# Altium schematic sheet Voltege_inverter.SchDoc
size 420 x 297 mm; CheckedBy: Филатов Д.М.; Author: Бондарчук А.П.; CompanyName: СПбГЭТУ "ЛЭТИ"; Organization: СПбГЭТУ "ЛЭТИ"; DocumentNumber: ЛЭТИ.0000.01 Э3; SheetNumber: 1; SheetTotal: 4
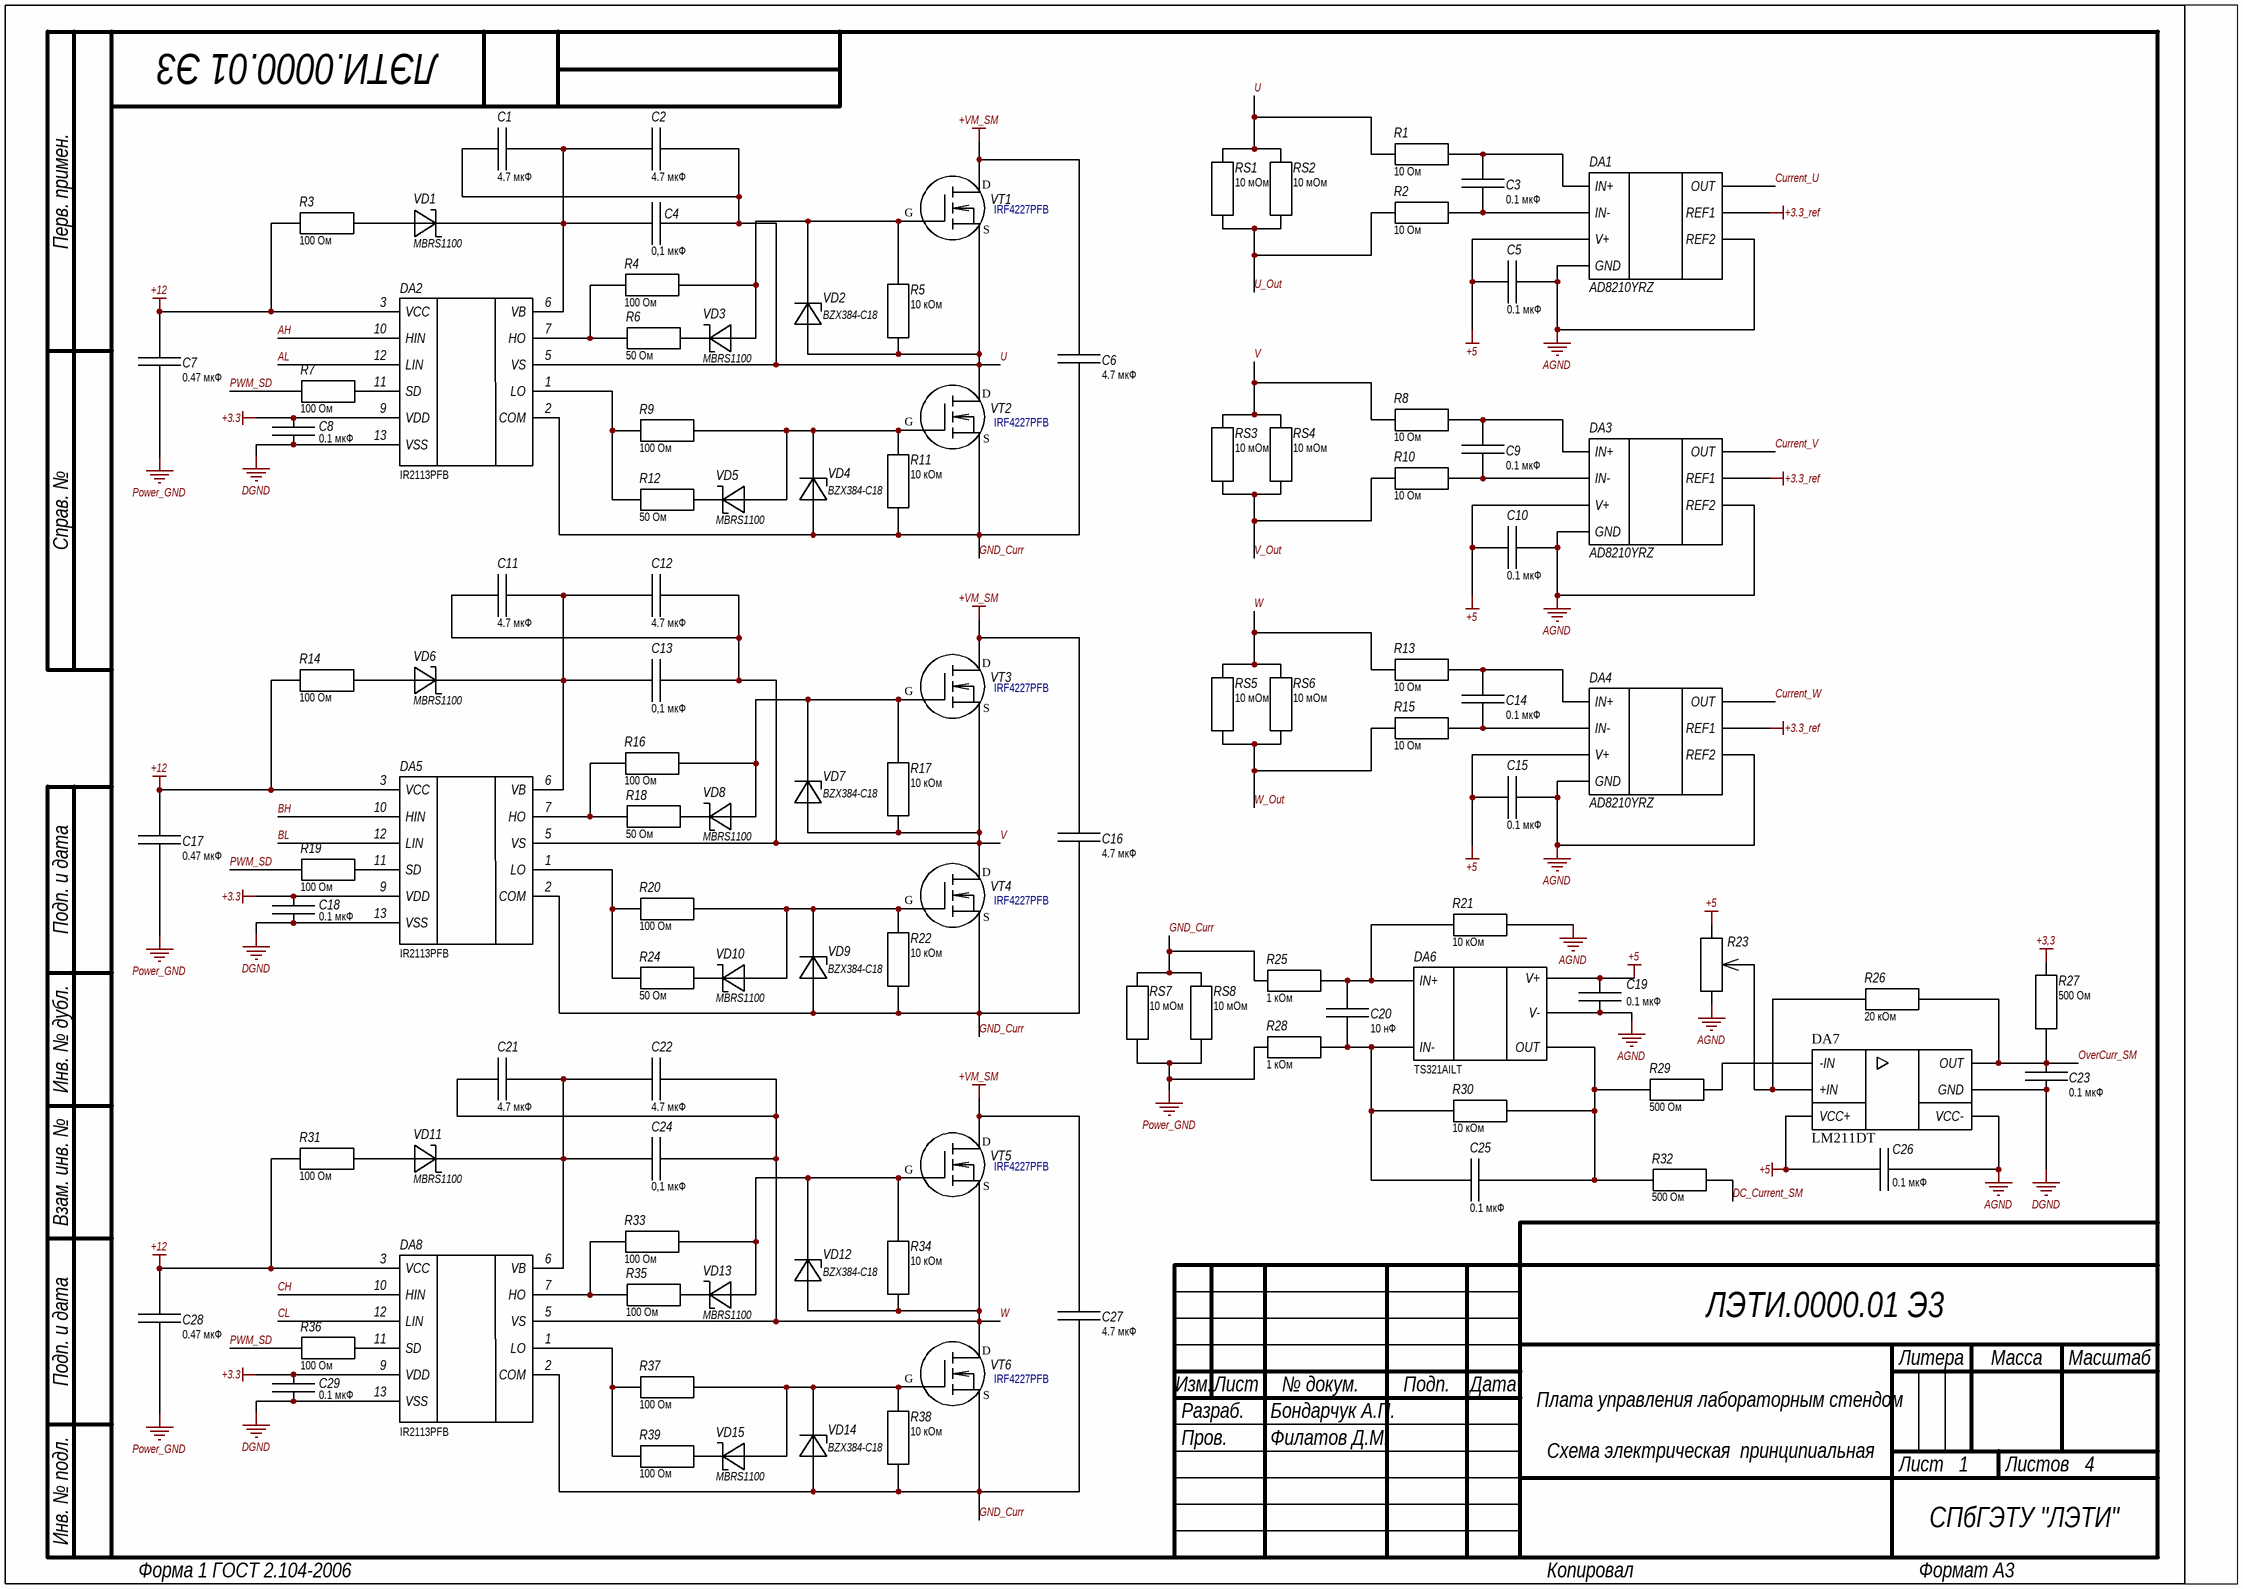
[diagram p0: Voltege_inverter.SchDoc]

## Parts
C1  value 4.7 мкФ  [CC1210]  (hidden comment: Capacitor)
C2  value 4.7 мкФ  [CC1210]  (hidden comment: Capacitor)
C3  value 0.1 мкФ  [CC1206]  (hidden comment: Capacitor)
C4  value 0,1 мкФ  [CC0805]  (hidden comment: Capacitor)
C5  value 0.1 мкФ  [CC0603]  (hidden comment: Capacitor)
C6  value 4.7 мкФ  [CC1210]  (hidden comment: Capacitor)
C7  value 0.47 мкФ  [CC1206]  (hidden comment: Capacitor)
C8  value 0.1 мкФ  [CC0603]  (hidden comment: Capacitor)
C9  value 0.1 мкФ  [CC1206]  (hidden comment: Capacitor)
C10  value 0.1 мкФ  [CC0603]  (hidden comment: Capacitor)
C11  value 4.7 мкФ  [CC1210]  (hidden comment: Capacitor)
C12  value 4.7 мкФ  [CC1210]  (hidden comment: Capacitor)
C13  value 0,1 мкФ  [CC0805]  (hidden comment: Capacitor)
C14  value 0.1 мкФ  [CC1206]  (hidden comment: Capacitor)
C15  value 0.1 мкФ  [CC0603]  (hidden comment: Capacitor)
C16  value 4.7 мкФ  [CC1210]  (hidden comment: Capacitor)
C17  value 0.47 мкФ  [CC1206]  (hidden comment: Capacitor)
C18  value 0.1 мкФ  [CC0603]  (hidden comment: Capacitor)
C19  value 0.1 мкФ  [CC0603]  (hidden comment: Capacitor)
C20  value 10 нФ  [CC0805]  (hidden comment: Capacitor)
C21  value 4.7 мкФ  [CC1210]  (hidden comment: Capacitor)
C22  value 4.7 мкФ  [CC1210]  (hidden comment: Capacitor)
C23  value 0.1 мкФ  [CC0603]  (hidden comment: Capacitor)
C24  value 0,1 мкФ  [CC0805]  (hidden comment: Capacitor)
C25  value 0.1 мкФ  [CC1206]  (hidden comment: Capacitor)
C26  value 0.1 мкФ  [CC0603]  (hidden comment: Capacitor)
C27  value 4.7 мкФ  [CC1210]  (hidden comment: Capacitor)
C28  value 0.47 мкФ  [CC1206]  (hidden comment: Capacitor)
C29  value 0.1 мкФ  [CC0603]  (hidden comment: Capacitor)
DA1  AD8210YRZ  [SO8]
DA2  IR2113PFB  [DIP14]
DA3  AD8210YRZ  [SO8]
DA4  AD8210YRZ  [SO8]
DA5  IR2113PFB  [DIP14]
DA6  TS321AILT  [SOT-23-5]
DA7  LM211DT  [SO8]
DA8  IR2113PFB  [DIP14]
R1  value 10 Ом  [RC1206]  (hidden comment: Resistor)
R2  value 10 Ом  [RC1206]  (hidden comment: Resistor)
R3  value 100 Ом  [RC2512]  (hidden comment: Resistor)
R4  value 100 Ом  [RC2512]  (hidden comment: Resistor)
R5  value 10 кОм  [RC0805]  (hidden comment: Resistor)
R6  value 50 Ом  [RC2512]  (hidden comment: Resistor)
R7  value 100 Ом  [RC0603]  (hidden comment: Resistor)
R8  value 10 Ом  [RC1206]  (hidden comment: Resistor)
R9  value 100 Ом  [RC2512]  (hidden comment: Resistor)
R10  value 10 Ом  [RC1206]  (hidden comment: Resistor)
R11  value 10 кОм  [RC0805]  (hidden comment: Resistor)
R12  value 50 Ом  [RC2512]  (hidden comment: Resistor)
R13  value 10 Ом  [RC1206]  (hidden comment: Resistor)
R14  value 100 Ом  [RC2512]  (hidden comment: Resistor)
R15  value 10 Ом  [RC1206]  (hidden comment: Resistor)
R16  value 100 Ом  [RC2512]  (hidden comment: Resistor)
R17  value 10 кОм  [RC0805]  (hidden comment: Resistor)
R18  value 50 Ом  [RC2512]  (hidden comment: Resistor)
R19  value 100 Ом  [RC0603]  (hidden comment: Resistor)
R20  value 100 Ом  [RC2512]  (hidden comment: Resistor)
R21  value 10 кОм  [RC0805]  (hidden comment: Resistor)
R22  value 10 кОм  [RC0805]  (hidden comment: Resistor)
R23  pot  [3296W]  (value not drawn)
R24  value 50 Ом  [RC2512]  (hidden comment: Resistor)
R25  value 1 кОм  [RC0805]  (hidden comment: Resistor)
R26  value 20 кОм  [RC0805]  (hidden comment: Resistor)
R27  value 500 Ом  [RC0805]  (hidden comment: Resistor)
R28  value 1 кОм  [RC0805]  (hidden comment: Resistor)
R29  value 500 Ом  [RC0805]  (hidden comment: Resistor)
R30  value 10 кОм  [RC0805]  (hidden comment: Resistor)
R31  value 100 Ом  [RC2512]  (hidden comment: Resistor)
R32  value 500 Ом  [RC0805]  (hidden comment: Resistor)
R33  value 100 Ом  [RC2512]  (hidden comment: Resistor)
R34  value 10 кОм  [RC0805]  (hidden comment: Resistor)
R35  value 100 Ом  [RC2512]  (hidden comment: Resistor)
R36  value 100 Ом  [RC0603]  (hidden comment: Resistor)
R37  value 100 Ом  [RC2512]  (hidden comment: Resistor)
R38  value 10 кОм  [RC0805]  (hidden comment: Resistor)
R39  value 100 Ом  [RC2512]  (hidden comment: Resistor)
RS1  value 10 мОм  [RC2816]  (hidden comment: Resistor)
RS2  value 10 мОм  [RC2816]  (hidden comment: Resistor)
RS3  value 10 мОм  [RC2816]  (hidden comment: Resistor)
RS4  value 10 мОм  [RC2816]  (hidden comment: Resistor)
RS5  value 10 мОм  [RC2816]  (hidden comment: Resistor)
RS6  value 10 мОм  [RC2816]  (hidden comment: Resistor)
RS7  value 10 мОм  [RC2816]  (hidden comment: Resistor)
RS8  value 10 мОм  [RC2816]  (hidden comment: Resistor)
VD1  MBRS1100  [DO-214AA]
VD2  BZX384-C18  [SOD323]
VD3  MBRS1100  [DO-214AA]
VD4  BZX384-C18  [SOD323]
VD5  MBRS1100  [DO-214AA]
VD6  MBRS1100  [DO-214AA]
VD7  BZX384-C18  [SOD323]
VD8  MBRS1100  [DO-214AA]
VD9  BZX384-C18  [SOD323]
VD10  MBRS1100  [DO-214AA]
VD11  MBRS1100  [DO-214AA]
VD12  BZX384-C18  [SOD323]
VD13  MBRS1100  [DO-214AA]
VD14  BZX384-C18  [SOD323]
VD15  MBRS1100  [DO-214AA]
VT1  IRF4227PFB  [TO247-1]
VT2  IRF4227PFB  [TO247-1]
VT3  IRF4227PFB  [TO247-1]
VT4  IRF4227PFB  [TO247-1]
VT5  IRF4227PFB  [TO247-1]
VT6  IRF4227PFB  [TO247-1]

## Nets
+3,3: R27.2
+3.3: C8.2 C18.2 C29.2 DA2.9(VDD) DA5.9(VDD) DA8.9(VDD)
+3.3_ref: DA1.7(REF1) DA3.7(REF1) DA4.7(REF1)
+5: C5.2 C10.2 C15.2 C19.1 C26.1 DA1.6(V+) DA3.6(V+) DA4.6(V+) DA6.5(V+) DA7.8(VCC+) R23.1
+12: C7.2 C17.2 C28.2 DA2.3(VCC) DA5.3(VCC) DA8.3(VCC) R3.2 R14.2 R31.2
+VM_SM: C6.2 C16.2 C27.2 VT1.D VT3.D VT5.D
AGND: C5.1 C10.1 C15.1 C19.2 C26.2 DA1.2(GND) DA1.3(REF2) DA3.2(GND) DA3.3(REF2) DA4.2(GND) DA4.3(REF2) DA6.2(V-) DA7.4(VCC-) R21.2 R23.3
DGND: C8.1 C18.1 C23.1 C29.1 DA2.13(VSS) DA5.13(VSS) DA7.1(GND) DA8.13(VSS)
Power_GND: C7.1 C17.1 C28.1 R28.1 RS7.2 RS8.2
AH: DA2.10(HIN)
AL: DA2.12(LIN)
BH: DA5.10(HIN)
BL: DA5.12(LIN)
CH: DA8.10(HIN)
CL: DA8.12(LIN)
Current_U: DA1.5(OUT)
Current_V: DA3.5(OUT)
Current_W: DA4.5(OUT)
DC_Current_SM: R32.2
GND_Curr: C6.1 C16.1 C27.1 DA2.2(COM) DA5.2(COM) DA8.2(COM) R11.2 R22.2 R25.1 R38.2 RS7.1 RS8.1 VD4.A VD9.A VD14.A VT2.S VT4.S VT6.S
OverCurr_SM: C23.2 DA7.7(OUT) R26.2 R27.1
PWM_SD: R7.2 R19.2 R36.2
U: C1.2 C2.1 C4.1 DA2.5(VS) R1.2 R5.2 RS1.1 RS2.1 VD2.A VT1.S VT2.D
U_Out: R2.2 RS1.2 RS2.2
V: C11.2 C12.1 C13.1 DA5.5(VS) R8.2 R17.2 RS3.1 RS4.1 VD7.A VT3.S VT4.D
V_Out: R10.2 RS3.2 RS4.2
W: C21.2 C22.1 C24.1 DA8.5(VS) R13.2 R34.2 RS5.1 RS6.1 VD12.A VT5.S VT6.D
W_Out: R15.2 RS5.2 RS6.2
NetC1_1: C1.1 C2.2 C4.2 DA2.6(VB) VD1.C
NetC3_1: C3.1 DA1.8(IN+) R1.1
NetC3_2: C3.2 DA1.1(IN-) R2.1
NetC9_1: C9.1 DA3.8(IN+) R8.1
NetC9_2: C9.2 DA3.1(IN-) R10.1
NetC11_1: C11.1 C12.2 C13.2 DA5.6(VB) VD6.C
NetC14_1: C14.1 DA4.8(IN+) R13.1
NetC14_2: C14.2 DA4.1(IN-) R15.1
NetC20_1: C20.1 DA6.3(IN+) R21.1 R25.2
NetC20_2: C20.2 C25.1 DA6.4(IN-) R28.2 R30.1
NetC21_1: C21.1 C22.2 C24.2 DA8.6(VB) VD11.C
NetC25_2: C25.2 DA6.1(OUT) R29.1 R30.2 R32.1
NetDA2_1: DA2.1(LO) R9.2 R12.2
NetDA2_7: DA2.7(HO) R4.2 R6.2
NetDA2_11: DA2.11(SD) R7.1
NetDA5_1: DA5.1(LO) R20.2 R24.2
NetDA5_7: DA5.7(HO) R16.2 R18.2
NetDA5_11: DA5.11(SD) R19.1
NetDA7_2: DA7.2(+IN) R23.2 R26.1
NetDA7_3: DA7.3(-IN) R29.2
NetDA8_1: DA8.1(LO) R37.2 R39.2
NetDA8_7: DA8.7(HO) R33.2 R35.2
NetDA8_11: DA8.11(SD) R36.1
NetR3_1: R3.1 VD1.A
NetR4_1: R4.1 R5.1 VD2.C VD3.A VT1.G
NetR6_1: R6.1 VD3.C
NetR9_1: R9.1 R11.1 VD4.C VD5.A
NetR12_1: R12.1 VD5.C
NetR14_1: R14.1 VD6.A
NetR16_1: R16.1 R17.1 VD7.C VD8.A VT3.G
NetR18_1: R18.1 VD8.C
NetR20_1: R20.1 R22.1 VD9.C VD10.A
NetR24_1: R24.1 VD10.C
NetR31_1: R31.1 VD11.A
NetR33_1: R33.1 R34.1 VD12.C VD13.A VT5.G
NetR35_1: R35.1 VD13.C
NetR37_1: R37.1 R38.1 VD14.C VD15.A
NetR39_1: R39.1 VD15.C

Not connected (* = marked no-connect by the designer): VT2 G; VT4 G; VT6 G

## Notes on the sheet
- Плата управления лабораторным стендом
- Перв. примен.
- Справ. №
- Подп. и дата
- Инв. № дубл.
- Взам. инв. №
- Разраб.
- Изм.
- Лист
- № докум.
- Подп.
- Дата
- Литера
- Масса
- Масштаб
- Пров.
- Схема электрическая  принципиальная
- Листов
- Инв. № подл.
- Форма 1 ГОСТ 2.104-2006
- Копировал
- Формат А3

## Library data of the parts
C1-C4 C6 C9 C11-C14 C16 C21 C22 C24 C25 C27 = Capacitor: Voltage: 100В; ComponentLink1Description: Product link; GOST_Name_2: 100В; GOST_Name_0: -
  C1 C2 C6 C11 C12 C16 C21 C22 C27: ComponentLink1URL: https://www.promelec.ru/product/413761/; Name: CC1210; GOST_Name_3: 4.7 мкФ
  C3 C9 C14 C25: ComponentLink1URL: *; Name: CC1206; GOST_Name_3: 0.1 мкФ
  C4 C13 C24: ComponentLink1URL: *; Name: CC0805; GOST_Name_3: 0,1 мкФ
C5 C8 C10 C15 C18 C19 C23 C26 C29 = Capacitor: Voltage: 16В; ComponentLink1Description: Product link; ComponentLink1URL: *; Name: CC0603; GOST_Name_2: 16В; GOST_Name_3: 0.1 мкФ; GOST_Name_0: -
C7 C17 C20 C28 = Capacitor: Voltage: 50В; ComponentLink1Description: Product link; ComponentLink1URL: *; GOST_Name_2: 50В; GOST_Name_0: -
  C7 C17 C28: Name: CC1206; GOST_Name_3: 0.47 мкФ
  C20: Name: CC0805; GOST_Name_3: 10 нФ
DA1 DA3 DA4 = AD8210: Name: AD8210YRZ, ф Analog Devices; ComponentLink1Description: Product link; ComponentLink1URL: https://www.chipdip.ru/product/ad8210yrz; Datasheet: https://static.chipdip.ru/lib/693/DOC011693392.pdf; GOST_Name_1: AD8210YRZ, ф Analog Devices
DA2 DA5 DA8 = IR2113PFB: Name: IR2113PBF, ф. Infineon Technologies; ComponentLink1Description: Product link; ComponentLink1URL: https://www.promelec.ru/product/39435/; GOST_Name_1: IR2113PBF, ф. Infineon Technologies
DA6 = TS321AILT: Одиночный операционный усилитель.; Name: TS321AILT ф. STMicroelectronics; ComponentLink1Description: Product link; ComponentLink1URL: https://www.chipdip.ru/product/ts321ailt-stm; Datasheet: https://static.chipdip.ru/lib/693/DOC011693392.pdf; GOST_Name_1: TS321AILT ф. STMicroelectronics
DA7 = LM211DT: Компаратор; GOST_Name_1: LM211DT, ф ST Microelectronics; ComponentLink1Description: Product link; ComponentLink1URL: https://www.promelec.ru/product/40196/
R1 R2 R8 R10 R13 R15 = Resistor: Power: 250 мВт; ComponentLink1Description: Product link; ComponentLink1URL: *; Name: RC1206; GOST_Name_2: 250 мВт; GOST_Name_3: 10 Ом; GOST_Name_0: -
R3 R4 R6 R9 R12 R14 R16 R18 R20 R24 R31 R33 R35 R37 R39 = Resistor: Power: 1 Вт; ComponentLink1Description: Product link; ComponentLink1URL: *; Name: RC2512; GOST_Name_2: 1 Вт; GOST_Name_0: -
  R3 R4 R9 R14 R16 R20 R31 R33 R35 R37 R39: GOST_Name_3: 100 Ом
  R6 R12 R18 R24: GOST_Name_3: 50 Ом
R5 R11 R17 R21 R22 R25-R30 R32 R34 R38 = Resistor: Power: 125 мВт; ComponentLink1Description: Product link; ComponentLink1URL: *; Name: RC0805; GOST_Name_2: 125 мВт; GOST_Name_0: -
  R5 R11 R17 R21 R22 R30 R34 R38: GOST_Name_3: 10 кОм
  R25 R28: GOST_Name_3: 1 кОм
  R26: GOST_Name_3: 20 кОм
  R27 R29 R32: GOST_Name_3: 500 Ом
R7 R19 R36 = Resistor: Power: 100 мВт; ComponentLink1Description: Product link; ComponentLink1URL: *; Name: RC0603; GOST_Name_2: 100 мВт; GOST_Name_3: 100 Ом; GOST_Name_0: -
R23 = pot: Name: 10 кОм ± 20% 0,5 Вт, 3296W-1-103LF, ф. Bourns; ComponentLink1Description: Product link; GOST_Name_1: 10 кОм ± 20% 0,5 Вт, 3296W-1-103LF, ф. Bourns
RS1-RS8 = Resistor: Power: 2 Вт; ComponentLink1Description: Product link; ComponentLink1URL: *; Name: RC2816; GOST_Name_2: 2 Вт; GOST_Name_3: 10 мОм; GOST_Name_0: -
VD1 VD3 VD5 VD6 VD8 VD10 VD11 VD13 VD15 = Shotki: Name: MBRS1100, 100В, 1А, ф. Sunmate Electronics; ComponentLink1Description: Product link; ComponentLink1URL: https://www.chipdip.ru/product/mbrs1100; GOST_Name_1: MBRS1100, 100В, 1А, ф. Sunmate Electronics
VD2 VD4 VD7 VD9 VD12 VD14 = Zener diode: Name: BZX384-C18,115, Стабилитрон 18В 0.3Вт, ф Nexperia; ComponentLink1Description: Product link; ComponentLink1URL: https://www.chipdip.ru/product/bzx384-c18.115; GOST_Name_1: BZX384-C18,115, Стабилитрон 18В 0.3Вт, ф Nexperia
VT1-VT6 = N-MOSFET: Name: IRF4227PFB